# Altium project SW1106_Demo_Project.PrjPcb
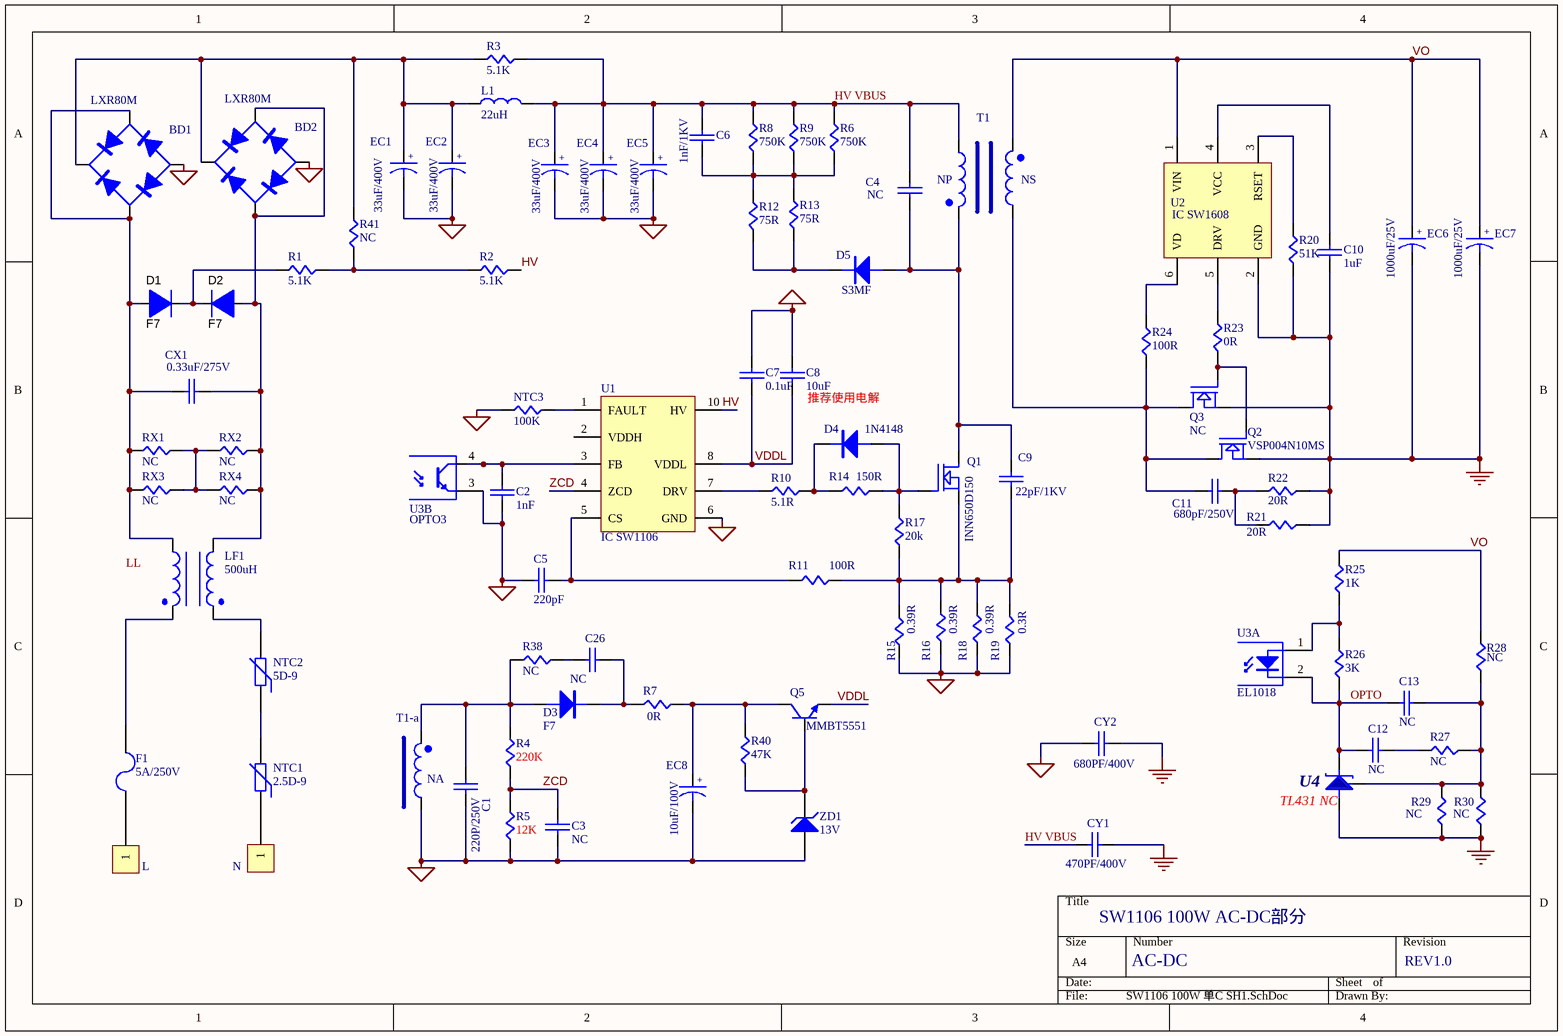
[diagram p0: SW1106 100W 单C SH1.SchDoc]
2 sheets, 118 parts. Net scope: global (net labels, ports and power ports of the same name join across sheets).
Board file: SW1106 100W 单C.PcbDoc
Sheets:
  SW1106 100W 单C SH1.SchDoc
  SW1106 100W 单C SH2.SchDoc

## Sheet SW1106 100W 单C SH1.SchDoc
size A4; SheetNumber: 1; SheetTotal: 1

### Parts
BD1  LXR80M  [BD-MBSL]
BD2  LXR80M  [BD-MBSL]
C1  220P/250V  [0603-C]
C2  1nF  [0603-C]
C3  NC  [0603-C]
C4  NC  [0805_C]
C5  220pF  [0603-C]
C6  1nF/1KV  [1206-C]
C7  0.1uF  [0805_C]
C8  10uF  [1206-C]
C9  22pF/1KV  [1206-C]
C10  1uF  [0603-C]
C11  680pF/250V  [0805_C]
C12  NC  [0603]
C13  NC  [0603]
C26  NC  [0805_C]
CX1  0.33uF/275V  [X-10-CAP - 3]
CY1  470PF/400V  [Y-SMD]
CY2  680PF/400V  [Y-SMD]
D1  F7  [SOD-123H]
D2  F7  [SOD-123H]
D3  F7  [SOD-123F]
D4  1N4148  [SOD-323]
D5  S3MF  [DIODE-S2MB]
EC1  33uF/400V  [CD-8/3.5]
EC2  33uF/400V  [CD-8/3.5]
EC3  33uF/400V  [CD-8/3.5]
EC4  33uF/400V  [CD-8/3.5]
EC5  33uF/400V  [CD-8/3.5]
EC6  1000uF/25V  [CD-6.3/2.3]
EC7  1000uF/25V  [CD-6.3/2.3]
EC8  10uF/100V  [CD-8/3.5]
F1  5A/250V  [F-8.5*4-P5]
L  L  [焊盘1.5mm]  (value not drawn)
L1  22uH  [LF-D8-P5]
LF1  500uH  [LF-9X3.2]
N  N  [焊盘1.5mm]  (value not drawn)
NS  (no value)
NTC1  2.5D-9  [5D9]
NTC2  5D-9  [5D9]
NTC3  100K  [0603-R]
Q1  INN650D150  [TO220-GDS]
Q2  VSP004N10MS  [TO220-GDS]
Q3  NC  [TO220-GDS]
Q5  MMBT5551  [SOT-23]
R1  5.1K  [1206-R]
R2  5.1K  [1206-R]
R3  5.1K  [1206-R]
R4  220K  [0603-R]
R5  12K  [0603-R]
R6  750K  [1206-R]
R7  0R  [0805-R]
R8  750K  [1206-R]
R9  750K  [1206-R]
R10  5.1R  [0603-R]
R11  100R  [0603-R]
R12  75R  [1206-R]
R13  75R  [1206-R]
R14  150R  [0603-R]
R15  0.39R  [1206-R]
R16  0.39R  [1206-R]
R17  20k  [0603-R]
R18  0.39R  [1206-R]
R19  0.3R  [1206-R]
R20  51K  [0603-R]
R21  20R  [0805-R]
R22  20R  [0805-R]
R23  0R  [0603-R]
R24  100R  [0603-R]
R25  1K  [0603-R]
R26  3K  [0603-R]
R27  NC  [0603]
R28  NC  [0603]
R29  NC  [0603]
R30  NC  [0603]
R38  NC  [0603-R]
R40  47K  [0805-R]
R41  NC  [1206-R]
RX1  NC  [1206-R]
RX2  NC  [1206-R]
RX3  NC  [1206-R]
RX4  NC  [1206-R]
T1  NP
T1-a  NA
U1  IC SW1106
U2  IC SW1608  [SOT23-6]
U3  EL1018  [EL1019]  (parts A,B of 2)
U4  TL431 NC  [TL431]
ZD1  13V  [DO-41]

### Nets
GND: C10.2 CY1.1 CY2.1 EC6.2 EC7.2 Q2.S Q3.S R20.1 R21.1 R22.1 R29.2 R30.1 U2.2(GND) U4.A
PGND: BD1.4 BD2.4 C1.2 C2.2 C3.2 C5.2 C7.1 C8.2 CY2.2 EC1.2 EC2.2 EC3.2 EC4.2 EC5.2 EC8.2 NTC3.2 R5.2 R15.1 R16.1 R18.1 R19.1 T1-a.1 U1.6(GND) U3.3 ZD1.1(A)
HV: R2.2 U1.10(HV)
HV VBUS: C4.1 C6.1 CY1.2 EC3.1 EC4.1 EC5.1 L1.1 R3.1 R6.2 R8.2 R9.2 T1.1
OPTO: C12.2 C13.2 R26.2 U3.2 U4.K
VDDL: C7.2 C8.1 Q5.3(E) U1.8(VDDL)
VO: EC6.1 EC7.1 NS.2 R25.1 R28.2 U2.1(VIN)
ZCD: C3.1 R4.2 R5.1 U1.4(ZCD)
NetBD1_1: BD1.1 BD2.1 EC1.1 EC2.1 L1.2 R3.2 R41.2
NetBD1_2: BD1.2 BD1.3 CX1.2 D1.2(A) LF1.3 RX1.1 RX3.1
NetBD2_2: BD2.2 BD2.3 CX1.1 D2.2(A) LF1.4 RX2.2 RX4.2
NetC1_1: C1.1 D3.1(A) R4.1 R38.1 T1-a.2
NetC2_1: C2.1 U1.3(FB) U3.4
NetC4_2: C4.2 C9.1 D5.1(A) Q1.D T1.2
NetC5_1: C5.1 R11.2 U1.5(CS)
NetC6_2: C6.2 R6.1 R8.1 R9.1 R12.2 R13.2
NetC9_2: C9.2 Q1.S R11.1 R15.2 R16.2 R17.2 R18.2 R19.2
NetC10_1: C10.1 U2.4(VCC)
NetC11_1: C11.1 NS.1 Q2.D Q3.D R24.2
NetC11_2: C11.2 R21.2 R22.2
NetC12_1: C12.1 R27.1
NetC13_1: C13.1 R27.2 R28.1 R29.1 R30.2 U4.R
NetC26_1: C26.1 D3.2(K) R7.1
NetC26_2: C26.2 R38.2
NetD1_1: D1.1(K) D2.1(K) R1.1
NetD4_1: D4.1(A) Q1.G R14.1 R17.1
NetD4_2: D4.2(K) R10.1 R14.2
NetD5_2: D5.2(K) R12.1 R13.1
NetEC8_1: EC8.1 Q5.2(C) R7.2 R40.2
NetF1_1: F1.1 LF1.2
NetF1_2: F1.2 L.1
NetLF1_1: LF1.1 NTC2.2
NetN_1: N.1 NTC1.1
NetNTC1_2: NTC1.2 NTC2.1
NetNTC3_1: NTC3.1 U1.1(FAULT)
NetQ2_G: Q2.G Q3.G R23.2
NetQ5_1: Q5.1(B) R40.1 ZD1.2(K)
NetR1_2: R1.2 R2.1 R41.1
NetR10_2: R10.2 U1.7(DRV)
NetR20_2: R20.2 U2.3(RSET)
NetR23_1: R23.1 U2.5(DRV)
NetR24_1: R24.1 U2.6(VD)
NetR25_2: R25.2 R26.1 U3.1
NetRX1_2: RX1.2 RX2.1 RX3.2 RX4.1

Not connected (* = marked no-connect by the designer): U1 2(VDDH)

### Notes on the sheet
- (near C8) 推荐使用电解
- SW1106 100W AC-DC部分
- AC-DC
- REV1.0
- Labels drawn without touching a wire or pin: LL
- (in symbol CAPACITOR POL) +

### Library data of the parts
BD1 BD2 = BRIDGE: Diode
C1-C13 C26 CY1 CY2 = CAP: Capacitor
CX1 = C: 安规电容CHAMPION  X2 / 尺寸：10X5X11mm（长X宽X高） / 脚距：7.5mm
D1 D2 = CSFMT108-HF: 1N4148 SOD323(0805); SymbolVersion: *; PartNumber: *; Manufacturer: *; PackageReference: *; CompType: *; U/M: *; Vf_V: *; Value: *; Value1: *; Value2: *; Io_A: *; Vr_V: *; TJmax_C: *; RJC_CperW: *; MountType: *; Type: *
D3 D4 = DIODE_1: Diode
D5 = DIODE
EC1-EC8 = CAPACITOR POL: Capacitor
F1 = FUSE
L N = CON1: Connector
L1 = L1: inductor
LF1 = LF-4-7: 16.2uH
NS T1 T1-a = INDUCTOR
NTC1 NTC2 = Res Varistor: Varistor (Voltage-Sensitive Resistor); Published: 24-Mar-1999; LatestRevisionDate: 29-May-2009; LatestRevisionNote: IPC-7351 Footprint Added.; PackageVersion: Mar-2003; PackageReference: 6-0805; Publisher: Altium Limited; PackageDescription: Chip Resistor 0805 Case Size; Code_IPC: RESC2012
NTC3 R1-R30 R38 R40 R41 RX1-RX4 = RES2
Q1-Q3 = NMOSFET (Z): SFS06R02UG 60V/3.2mR PDFN5*6 东微
Q5 = NPN: NPN 三极管
U3 = OPTO3: Optoisolator
U4 = IC431
ZD1 = D Zener: 稳压管

## Sheet SW1106 100W 单C SH2.SchDoc
size A4; SheetNumber: 2; SheetTotal: 2
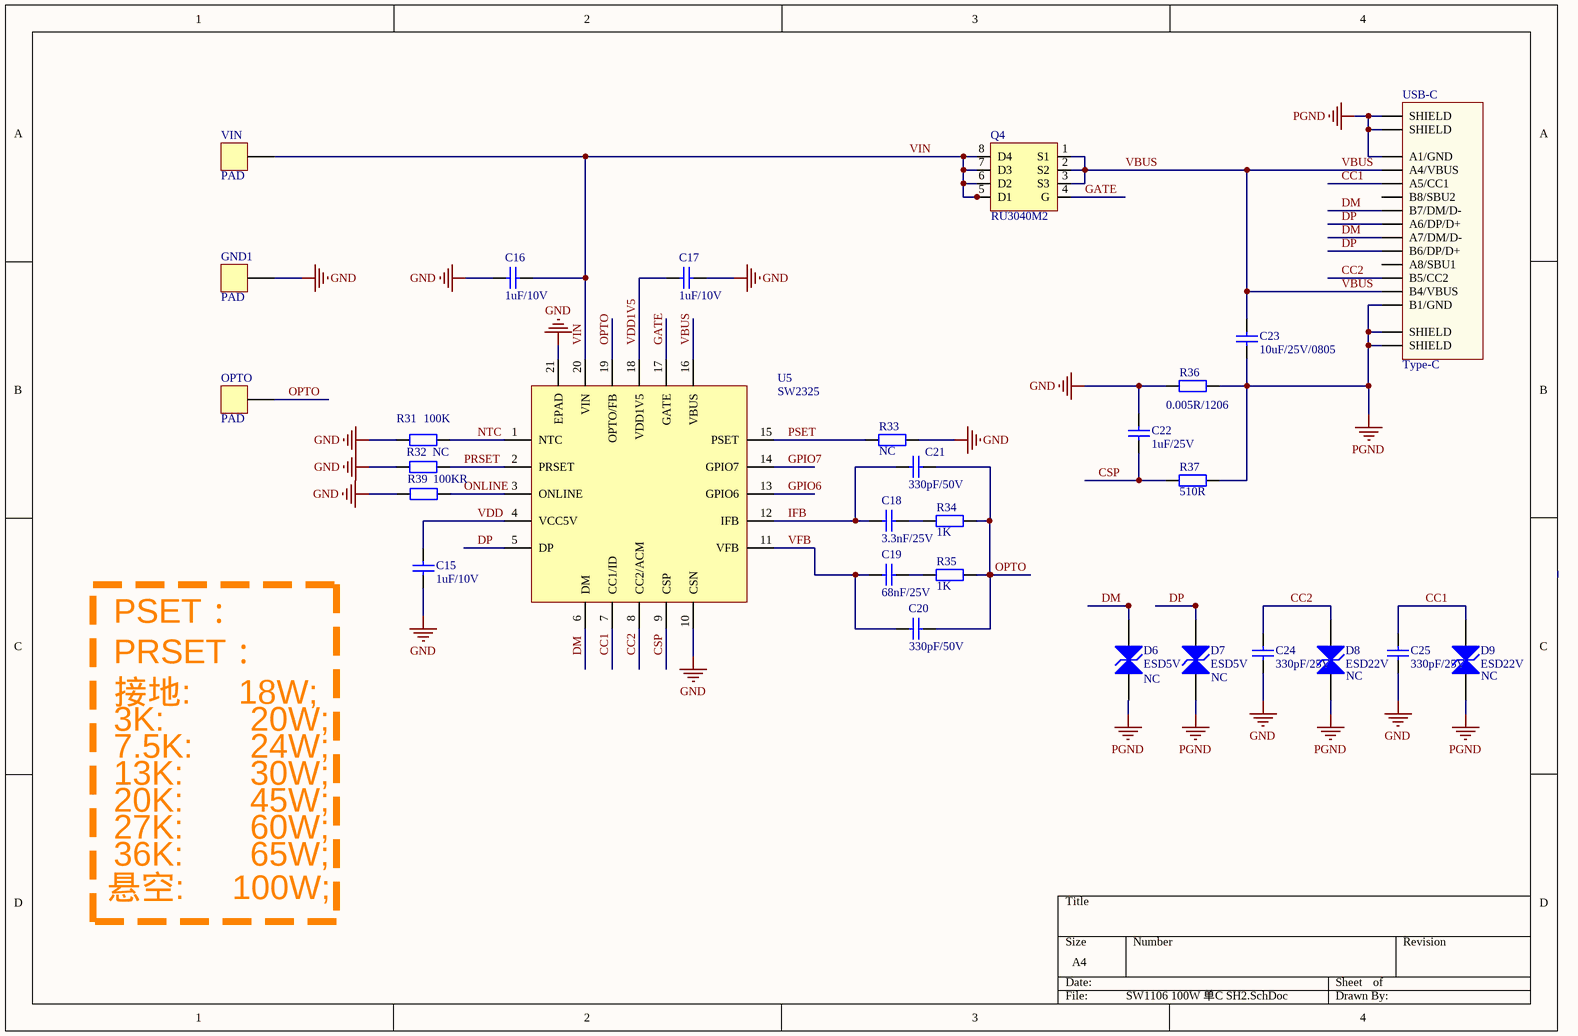
[diagram p1: SW1106 100W 单C SH2.SchDoc]

### Parts
C15  1uF/10V  [C 0603]
C16  1uF/10V  [C 0603]
C17  1uF/10V  [C 0603]
C18  3.3nF/25V  [C 0603]
C19  68nF/25V  [C 0603]
C20  330pF/50V  [C 0603]
C21  330pF/50V  [C 0603]
C22  1uF/25V  [C 0603]
C23  10uF/25V/0805  [C 0805]
C24  330pF/25V  [C 0603]
C25  330pF/25V  [C 0603]
D6  ESD5V  [SOD-523]
D7  ESD5V  [SOD-523]
D8  ESD22V  [SOD-523]
D9  ESD22V  [SOD-523]
GND1  PAD  [PAD]
OPTO  PAD  [PAD]
Q4  RU3040M2  [PDFN-3*3]
R31  100K  [R 0603]
R32  NC  [R 0603]
R33  NC  [R 0603]
R34  1K  [R 0603]
R35  1K  [R 0603]
R36  0.005R/1206  [R 1206]
R37  510R  [R 0603]
R39  100KR  [R 0603]
U5  SW2325  [SW232X_QFN20-4X4]
USB-C  Type-C  [USB_C_16PIN]
VIN  PAD  [PAD]

### Nets
GND: C15.1 C16.1 C17.1 C22.2 C24.1 C25.1 GND1.1(PAD) R31.1 R32.1 R33.2 R36.1 R39.1 U5.10(CSN) U5.21(EPAD)
PGND: C23.1 D6.1(A) D7.1(A) D8.1(A) D9.1(A) R36.2 R37.2 USB-C.1(SHIELD) USB-C.2(SHIELD) USB-C.3(SHIELD) USB-C.4(SHIELD) USB-C.A1(A1/GND) USB-C.B1(B1/GND)
CC1: C25.2 D9.2(K) U5.7(CC1/ID) USB-C.A5(A5/CC1)
CC2: C24.2 D8.2(K) U5.8(CC2/ACM) USB-C.B5(B5/CC2)
CSP: C22.1 R37.1 U5.9(CSP)
DM: D6.2(K) U5.6(DM) USB-C.A7(A7/DM/D-) USB-C.B7(B7/DM/D-)
DP: D7.2(K) U5.5(DP) USB-C.A6(A6/DP/D+) USB-C.B6(B6/DP/D+)
GATE: Q4.4(G) U5.17(GATE)
GPIO6: U5.13(GPIO6)
GPIO7: U5.14(GPIO7)
IFB: C18.1 C21.1 U5.12(IFB)
NTC: R31.2 U5.1(NTC)
ONLINE: R39.2 U5.3(ONLINE)
OPTO: C20.2 C21.2 OPTO.1(PAD) R34.2 R35.2 U5.19(OPTO/FB)
PRSET: R32.2 U5.2(PRSET)
PSET: R33.1 U5.15(PSET)
VBUS: C23.2 Q4.1(S1) Q4.2(S2) Q4.3(S3) U5.16(VBUS) USB-C.A4(A4/VBUS) USB-C.B4(B4/VBUS)
VDD: C15.2 U5.4(VCC5V)
VDD1V5: C17.2 U5.18(VDD1V5)
VFB: C19.1 C20.1 U5.11(VFB)
VIN: C16.2 Q4.5(D1) Q4.6(D2) Q4.7(D3) Q4.8(D4) Q4.9(EPAD) U5.20(VIN) VIN.1(PAD)
NetC18_2: C18.2 R34.1
NetC19_2: C19.2 R35.1

Not connected (* = marked no-connect by the designer): USB-C A8(A8/SBU1) B8(B8/SBU2)

### Notes on the sheet
- PSET：
- 接地:     18W;
- PRSET：
- (near D6) NC
- (near D7) NC
- (near D8) NC
- (near D9) NC
- 3K:         20W;
- 7.5K:      24W;
- 13K:       30W;
- 20K:       45W;
- 27K:       60W;
- 悬空:     100W;
- 36K:       65W;

### Library data of the parts
C15-C25 = Capacitor: 电容-无极性
D6-D9 = Diode_ESD: 防静电二极管
Q4 = MOSFET-PDFN: PDFN封装N-MOS
R31-R37 R39 = Resistance: 电阻
U5 = SW2325: 智融科技SW2325
USB-C = Type-C_16Pin: USB-C

## Nets that join several sheets
GND: SW1106 100W 单C SH1 (14 pins), SW1106 100W 单C SH2 (14 pins)
PGND: SW1106 100W 单C SH1 (25 pins), SW1106 100W 单C SH2 (13 pins)
OPTO: SW1106 100W 单C SH1 (5 pins), SW1106 100W 单C SH2 (6 pins)